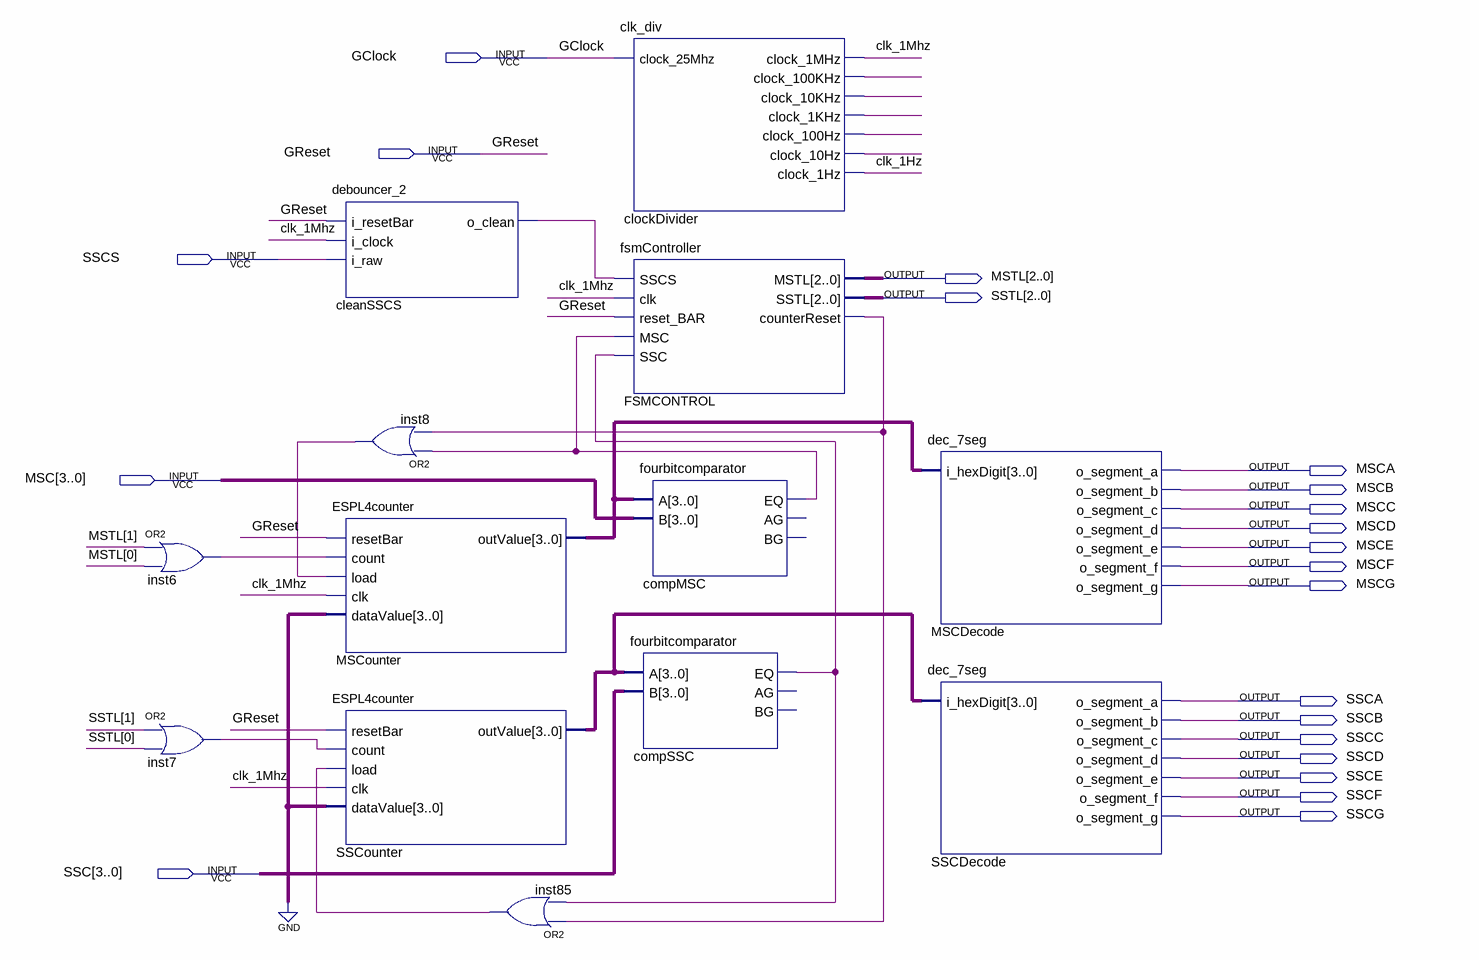
[diagram p0: schematic sheet]
// Quartus schematic trafficLightController.bdf as structural Verilog: 13 symbols, 21 pins
module trafficLightController (
  input  GClock,
  input  GReset,
  input  SSCS,
  input  [3:0] MSC,
  input  [3:0] SSC,
  output [2:0] MSTL,
  output [2:0] SSTL,
  output MSCA,
  output MSCB,
  output MSCC,
  output MSCD,
  output MSCE,
  output MSCF,
  output MSCG,
  output SSCA,
  output SSCB,
  output SSCC,
  output SSCD,
  output SSCE,
  output SSCF,
  output SSCG
);

  wire cleanSSCS_o_clean, clk_1Hz, clk_1Mhz, clockDivider_clock_1khz, clockDivider_clock_10hz,
       clockDivider_clock_10khz, clockDivider_clock_100hz, clockDivider_clock_100khz, compMSC_eq, compSSC_eq,
       FSMCONTROL_counterreset, inst6_out, inst7_out, inst8_out, inst85_out;
  wire [3:0] MSCounter_outvalue, SSCounter_outvalue;

  or inst6 (inst6_out, MSTL[1], MSTL[0]);
  or inst7 (inst7_out, SSTL[1], SSTL[0]);
  debouncer_2 cleanSSCS (.i_resetBar(GReset), .i_clock(clk_1Mhz), .i_raw(SSCS), .o_clean(cleanSSCS_o_clean));
  or inst8 (inst8_out, compMSC_eq, FSMCONTROL_counterreset);
  ESPL4counter MSCounter (
    .resetBar(GReset), .count(inst6_out), .load(inst8_out), .clk(clk_1Mhz), .dataValue(4'b0000),
    .outValue(MSCounter_outvalue));
  ESPL4counter SSCounter (
    .resetBar(GReset), .count(inst7_out), .load(inst85_out), .clk(clk_1Mhz), .dataValue(4'b0000),
    .outValue(SSCounter_outvalue));
  or inst85 (inst85_out, FSMCONTROL_counterreset, compSSC_eq);
  clk_div clockDivider (
    .clock_25Mhz(GClock), .clock_1MHz(clk_1Mhz), .clock_100KHz(clockDivider_clock_100khz),
    .clock_10KHz(clockDivider_clock_10khz), .clock_1KHz(clockDivider_clock_1khz),
    .clock_100Hz(clockDivider_clock_100hz), .clock_10Hz(clockDivider_clock_10hz), .clock_1Hz(clk_1Hz));
  fsmController FSMCONTROL (
    .SSCS(cleanSSCS_o_clean), .clk(clk_1Mhz), .reset_BAR(GReset), .MSC(compMSC_eq), .SSC(compSSC_eq),
    .MSTL(MSTL), .SSTL(SSTL), .counterReset(FSMCONTROL_counterreset));
  fourbitcomparator compMSC (.A(MSCounter_outvalue), .B(MSC), .EQ(compMSC_eq));  // open: AG, BG
  fourbitcomparator compSSC (.A(SSCounter_outvalue), .B(SSC), .EQ(compSSC_eq));  // open: AG, BG
  dec_7seg MSCDecode (
    .i_hexDigit(MSCounter_outvalue), .o_segment_a(MSCA), .o_segment_b(MSCB), .o_segment_c(MSCC),
    .o_segment_d(MSCD), .o_segment_e(MSCE), .o_segment_f(MSCF), .o_segment_g(MSCG));
  dec_7seg SSCDecode (
    .i_hexDigit(SSCounter_outvalue), .o_segment_a(SSCA), .o_segment_b(SSCB), .o_segment_c(SSCC),
    .o_segment_d(SSCD), .o_segment_e(SSCE), .o_segment_f(SSCF), .o_segment_g(SSCG));
endmodule
